# EAGLE design untitled (EAGLE 6.1)
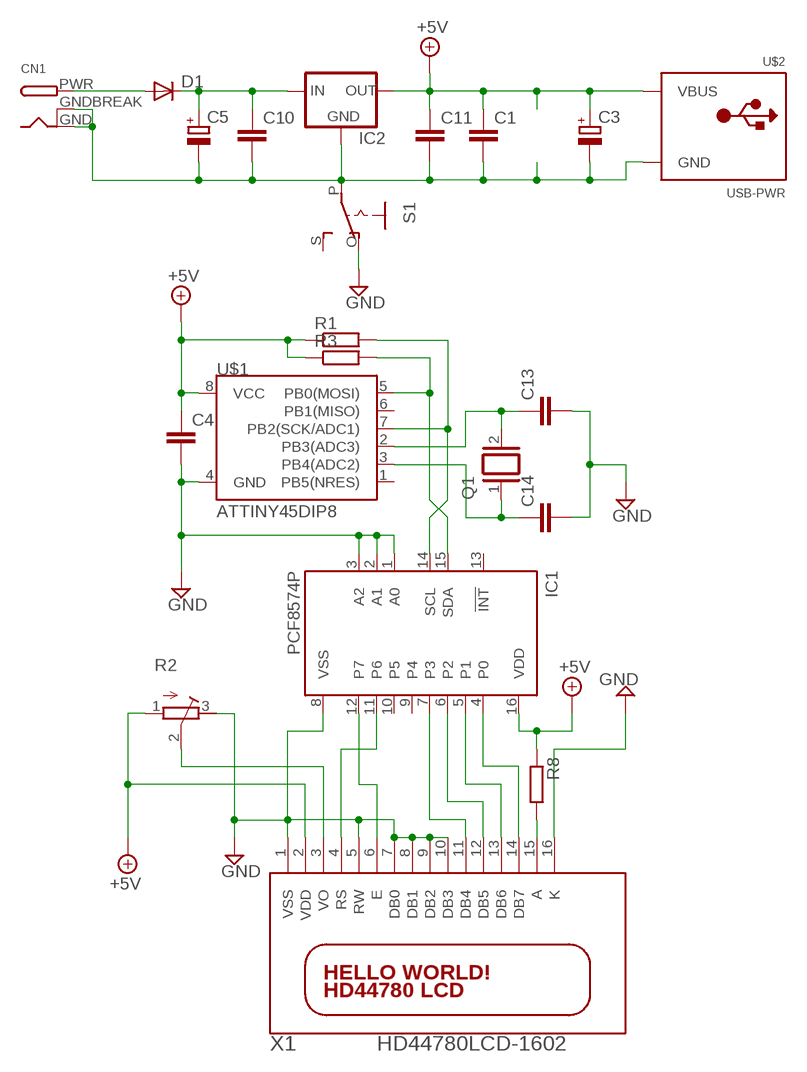
[diagram p0: schematic, sheet 1]

## Parts
C1  C-EU025-025X050  [C025-025X050]
C3  CPOL-EUE2.5-6  [E2,5-6]
C4  C-EU025-025X050  [C025-025X050]
C5  CPOL-EUE2.5-6  [E2,5-6]
C10  C-EU025-025X050  [C025-025X050]
C11  C-EU025-025X050  [C025-025X050]
C13  C-EU025-025X050  [C025-025X050]
C14  C-EU025-025X050  [C025-025X050]
CN1  DCBARRELPTH  [DCJACK_2MM_PTH]
D1  DIODE-D-2.5  [D-2.5]
IC1  PCF8574P  [DIL16]
IC2  V_REG_78XXSIDE  [78XXL]
Q1  XTAL/S  [QS]
R1  R-EU_0207/2V  [0207/2V]
R2  R-TRIMM3339P  [RTRIM3339P]
R3  R-EU_0207/5V  [0207/5V]
R8  R-EU_0207/10  [0207/10]
S1  EG1218S  [EG1218]
U$1  ATTINY45DIP8  [DIP08]
U$2  USB-PWR  [USB-MINIB-THM-MOLEX-PWRONLY]
X1  HD44780LCD-1602  [LCD1602]

## Nets
+5V: C1.1 C3.+ C4.1 C11.1 IC1.16(VDD) IC2.OUT R1.1 R2.1(A) R3.1 R8.1 U$1.8(VCC) U$2.VBUS X1.2(VDD)
GND: C4.2 C13.2 C14.2 IC1.1(A0) IC1.2(A1) IC1.3(A2) IC1.8(VSS) R2.3(E) S1.O U$1.4(GND) X1.1(VSS) X1.5(RW) X1.7(DB0) X1.8(DB1) X1.9(DB2) X1.10(DB3) X1.16(K)
N$1: C5.+ C10.1 D1.C IC2.IN
N$2: IC1.12(P7) X1.6(E)
N$3: IC1.6(P2) X1.12(DB5)
N$4: IC1.7(P3) X1.11(DB4)
N$5: R8.2 X1.15(A)
N$6: IC1.5(P1) X1.13(DB6)
N$7: IC1.4(P0) X1.14(DB7)
N$8: R2.2(S) X1.3(VO)
N$9: C1.2 C3.- C5.- C10.2 C11.2 CN1.GND CN1.GNDBREAK IC2.GND S1.P U$2.GND
N$11: C13.1 Q1.2 U$1.2(PB3(ADC3))
N$12: IC1.11(P6) X1.4(RS)
N$13: C14.1 Q1.1 U$1.3(PB4(ADC2))
N$14: CN1.PWR D1.A
N$16: IC1.15(SDA) R3.2 U$1.5(PB0(MOSI))
N$17: IC1.14(SCL) R1.2 U$1.7(PB2(SCK/ADC1))
Unconnected: IC1.9(P4) IC1.10(P5) IC1.13(!INT) S1.S U$1.1(PB5(NRES)) U$1.6(PB1(MISO))

## Library data of the parts
C1 C4 C10 C11 C13 C14 = rcl:C-EU: CAPACITOR, European symbol
C3 C5 = rcl:CPOL-EU: POLARIZED CAPACITOR, European symbol
CN1 = adafruit:DCBARREL: 2.0mm DC Barrel Jack DCJACK_2MM_PTH - Through Hole Jack (4UConnector: 05537)
D1 = diode:DIODE-: DIODE
IC1 = micro-philips:PCF8574: I2C-Bus Remote 8-bit I/O expander http://www.semiconductors.philips.com/acrobat_download/datasheets/PCF8574_4.pdf; MPN: PCF8574PN; OC_FARNELL: 204020; OC_NEWARK: 11N8515
IC2 = SparkFun:V_REG_78XX: Voltage Regulator Standard 7805 5V regulator. IGO (Input Ground Output). Spark Fun Electronics SKU : COM-00107
Q1 = special:XTAL/S: CRYSTAL
R1 R3 R8 = rcl:R-EU_: RESISTOR, European symbol
R2 = rcl:R-TRIMM: Trimm resistor
S1 = adafruit:EG1218: SLIDING SWITCH 0.1" spacing through hole, vertical SPDT slide switch http://www.ladyada.net/library/pcb/eaglelibrary.html
U$1 = SparkFun:ATTINY45: Atmel ATTiny45
U$2 = adafruit:USB-PWR
X1 = adafruit:HD44780LCD: HD44780 LCD Standard character type LCDs, available in sizes from 8x1 to 40x4!

## Board
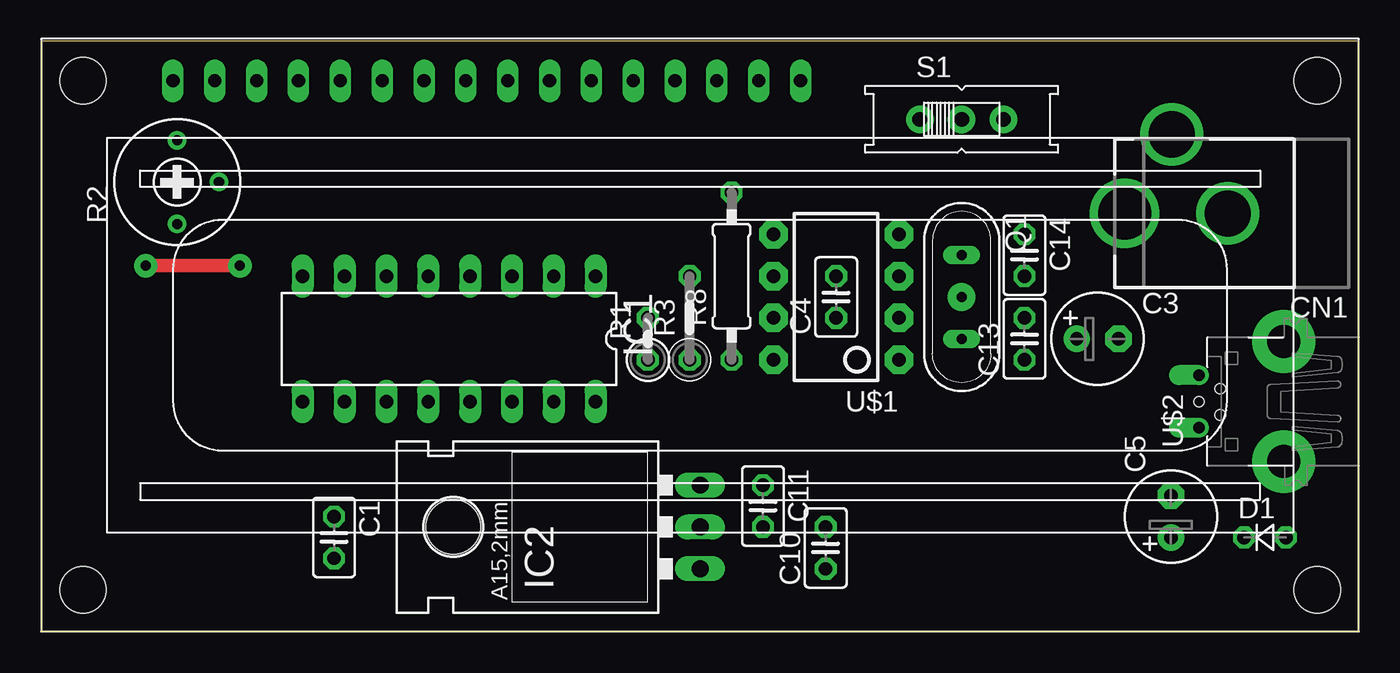
[diagram p1: board, top side]
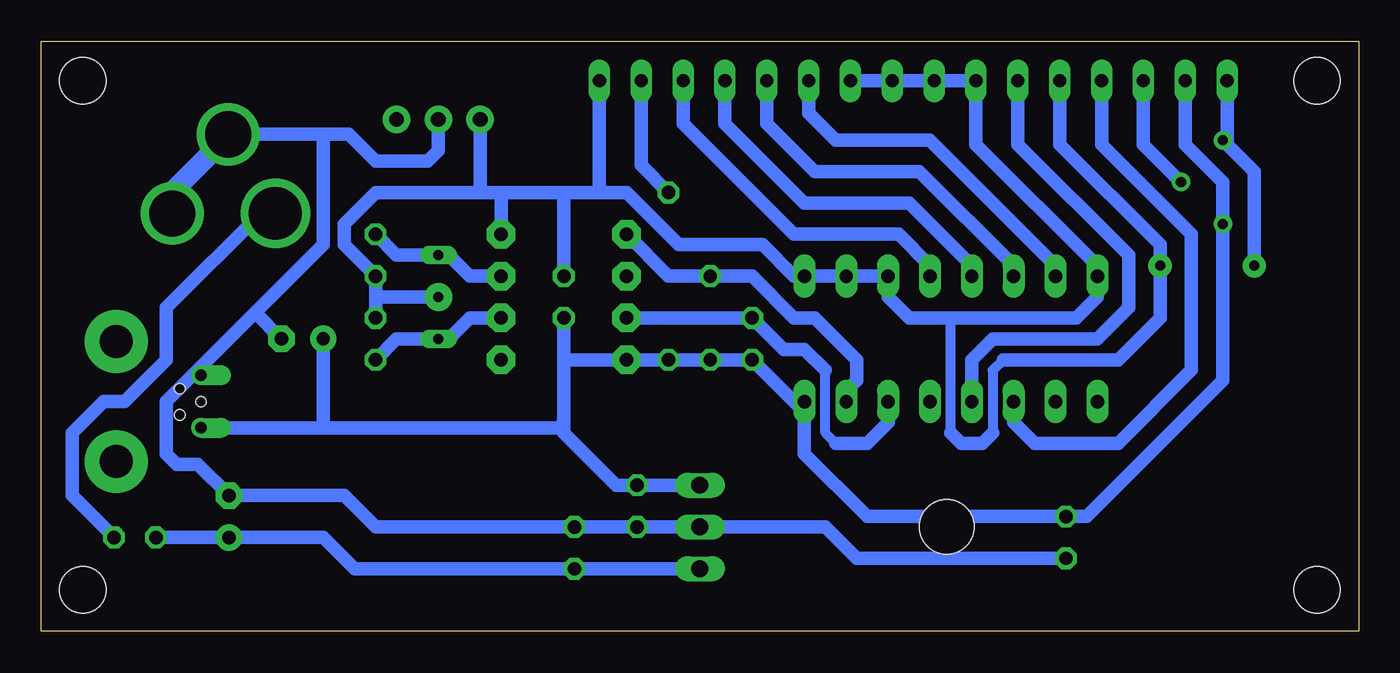
[diagram p2: board, bottom side, seen from below]

Size 79.99 x 35.87 mm. Coordinates in mm from the lower left corner, seen from the top.
Outline: 0,0 79.99,0 79.99,35.87 0,35.87 0,0
Copper layers (1*16): Top 0.035mm / dielectric 1.5mm / Bottom 0.035mm
Design rules: minimum track width 10mil, minimum drill 24mil, track to track 8mil, track to pad 8mil, pad to pad 8mil, via to via 8mil, smd to smd 8mil, copper to edge 40mil, drill to drill 8mil, minimum pad ring 10mil, minimum via ring 8mil, stop-mask expansion 4mil, vias tented up to drill 0mil, thermal gap 10mil

### Footprints (pad centres in the part's own frame; a part is rotated, then mirrored left to right if it is on the bottom)
C025-025X050 = drill 0.813 octagon: 1 -1.27,0; 2 1.27,0
E2,5-6 = drill 0.813 pad 1.6: + -1.27,0 | drill 0.813 pad 1.6 octagon: - 1.27,0
DCJACK_2MM_PTH = drill 2.8: GND 0,7.35; GNDBREAK 4.8,10.75 | drill 3.2: PWR 0,13.6
D-2.5 = drill 0.813 octagon: A 1.27,0; C -1.27,0
DIL16 = drill 0.813 long: 1 -8.89,-3.81; 2 -6.35,-3.81; 3 -3.81,-3.81; 4 -1.27,-3.81; 5 1.27,-3.81; 6 3.81,-3.81; 7 6.35,-3.81; 8 8.89,-3.81; 9 8.89,3.81; 10 6.35,3.81; 11 3.81,3.81; 12 1.27,3.81; 13 -1.27,3.81; 14 -3.81,3.81; 15 -6.35,3.81; 16 -8.89,3.81
78XXL = drill 1.016 long: GND 0,-3.81; IN -2.54,-3.81; OUT 2.54,-3.81 | hole 3.302: 0,11.176
QS = drill 0.61 long: 1 -2.54,0; 2 2.54,0
0207/2V = drill 0.813 octagon: 1 -1.27,0; 2 1.27,0
RTRIM3339P = drill 0.61: 1 -2.54,0; 2 0,-2.54; 3 2.54,0
0207/5V = drill 0.813 octagon: 1 -2.54,0; 2 2.54,0
0207/10 = drill 0.813 octagon: 1 -5.08,0; 2 5.08,0
EG1218 = drill 0.9 pad 1.676: O -2.54,0; P 0,0; S 2.54,0
DIP08 = drill 0.813 pad 1.727 octagon: 1 -3.81,-3.81; 2 -1.27,-3.81; 3 1.27,-3.81; 4 3.81,-3.81; 5 3.81,3.81; 6 1.27,3.81; 7 -1.27,3.81; 8 -3.81,3.81
USB-MINIB-THM-MOLEX-PWRONLY = drill 0.7 offset: GND 1.6,4.64; VBUS -1.6,4.64 | drill 2 pad 3.81: GND1 -3.65,-0.51; GND4 3.65,-0.51 | hole 0.6: 0,4.648; 0.787,3.353; -0.813,3.353
LCD1602 = drill 0.8 long: 1 8,33.46; 2 10.54,33.46; 3 13.08,33.46; 4 15.62,33.46; 5 18.16,33.46; 6 20.7,33.46; 7 23.24,33.46; 8 25.78,33.46; 9 28.32,33.46; 10 30.86,33.46; 11 33.4,33.46; 12 35.94,33.46; 13 38.48,33.46; 14 41.02,33.46; 15 43.56,33.46; 16 46.1,33.46 | hole 2.8: 2.54,2.54; 2.54,33.46; 77.46,33.46; 77.46,2.54

### Placement (x,y rotation side)
C1  17.78,5.71 270 top
C3  64.14,17.78 0 top
C4  48.26,20.32 90 top
C5  68.58,6.99 90 top
C10  47.62,5.08 90 top
C11  43.81,7.62 270 top
C13  59.69,17.78 90 top
C14  59.69,22.86 270 top
CN1  79.38,25.4 90 top
D1  74.3,5.71 0 top
IC1  24.77,17.78 180 top
IC2  36.2,6.35 90 top
Q1  55.88,20.32 270 top
R1  36.83,17.78 90 top
R2  8.26,27.3 90 top
R3  39.37,19.05 90 top
R8  41.91,21.59 90 top
S1  55.88,31.11 0 top
U$1  48.26,20.32 90 top
U$2  74.93,13.97 90 top
X1  0,0 0 top

### Tracks (layer width: path | path; a pad name or v marks a point on that pad's centre or on a via)
+5V
  Bottom 0.813: C4.1 48.26,16.51 | 48.26,16.51 U$1.8 R8.1 R3.1 R1.1 33.66,13.34 | 33.66,13.34 33.66,10.79 29.84,6.99 C1.1 16.51,6.99 8.26,15.24 R2.1 8.26,27.3 10.54,29.59 X1.2 | U$2.VBUS 62.87,12.37 | 62.87,12.37 48.56,12.37 48.56,12.39 48.26,12.7 | IC2.OUT C11.1 45.09,8.89 48.26,12.06 48.26,12.7 | 48.26,16.51 48.26,12.7 | C3.+ 62.87,12.37 | 33.66,13.34 IC1.16
GND  (via drill 0.6 pad 1.42, 0.6 pad 1.68)
  Top 0.813: v6.35,22.23 v12.06,22.23
  Bottom 0.61: 21.59,16.51 22.23,15.88 22.23,12.06 | 24.77,12.06 24.77,19.05
  Bottom 0.813: 59.69,20.32 C13.2 C14.2 | 59.69,20.32 C14.2 | v55.88,20.32 59.69,20.32 | X1.10 X1.9 X1.8 X1.7 23.24,29.59 15.88,22.23 IC1.8 15.88,20.32 17.14,19.05 24.77,19.05 27.3,19.05 28.57,20.32 IC1.3 IC1.2 IC1.1 34.29,21.59 36.2,23.5 41.27,23.5 44.45,26.67 46.1,26.67 | 48.26,26.67 46.1,26.67 | X1.16 46.1,26.67 | C4.2 48.26,26.67 | 48.26,26.67 52.07,26.67 | U$1.4 52.07,26.67 | 53.34,26.67 S1.O | 52.07,26.67 53.34,26.67 | C14.2 61.59,23.5 61.59,24.77 59.69,26.67 53.34,26.67 | 21.59,16.51 14.61,16.51 12.06,19.05 v12.06,22.23 12.06,23.5 18.16,29.59 X1.5 | 22.23,12.06 22.86,11.43 24.13,11.43 24.77,12.06 | X1.1 8,29.84 | 8,29.84 8,29.59 6.35,27.94 v6.35,22.23 | R2.3 8,29.84
N$1
  Bottom 0.813: D1.C C5.+ 62.87,5.71 60.96,3.81 C10.1 IC2.IN
N$2
  Bottom 0.813: X1.6 20.7,29.59 13.97,22.86 13.97,19.68 15.88,17.78 22.23,17.78 23.5,16.51 IC1.12
N$3
  Bottom 0.813: IC1.6 20.95,22.23 26.67,27.94 33.02,27.94 35.94,30.86 X1.12
N$4
  Bottom 0.813: IC1.7 18.41,22.23 26.04,29.84 31.75,29.84 33.4,31.5 X1.11
N$5
  Bottom 0.813: X1.15 43.56,28.32 R8.2
N$6
  Bottom 0.813: IC1.5 23.5,22.23 27.3,26.04 33.66,26.04 38.48,30.86 X1.13
N$7
  Bottom 0.813: IC1.4 26.04,22.23 27.94,24.13 34.29,24.13 41.02,30.86 X1.14
N$8
  Bottom 0.813: X1.3 13.08,29.59 R2.2
N$9
  Bottom 0.813: 71.75,27.3 68.86,30.2 CN1.GNDBREAK 62.87,30.2 | 70.48,15.88 72.39,13.97 72.39,10.79 71.75,10.16 70.48,10.16 C5.- 61.59,8.26 59.69,6.35 C10.2 C11.2 IC2.GND 32.38,6.35 30.48,4.45 C1.2 | U$2.GND 70.29,15.68 70.48,15.88 | S1.P 55.88,29.21 56.52,28.57 59.69,28.57 61.31,30.2 62.87,30.2 | CN1.GND 72.03,27.04 71.75,27.3 | 71.75,27.3 71.12,27.3 68.58,29.84 | 70.48,15.88 66.99,19.37 | 66.99,19.37 62.87,23.5 62.87,30.2 | C3.- 66.99,19.37
N$11
  Bottom 0.813: U$1.2 53.98,19.05 55.24,17.78 Q1.2 58.42,17.78 C13.1
N$12
  Bottom 0.813: X1.4 15.62,29.59 10.16,24.13 10.16,15.88 14.61,11.43 19.68,11.43 20.95,12.7 IC1.11
N$13
  Bottom 0.813: U$1.3 53.98,21.59 55.24,22.86 Q1.1 58.42,22.86 C14.1
N$14
  Bottom 0.813: CN1.PWR 66.67,25.4 72.39,19.68 72.39,16.51 74.93,13.97 76.2,13.97 78.11,12.06 78.11,8.26 D1.A
N$16
  Bottom 0.813: U$1.5 41.91,21.59 R3.2 36.83,21.59 34.29,19.05 33.02,19.05 30.48,16.51 30.48,15.24 31.11,14.61 IC1.15
N$17
  Bottom 0.61: 32.38,15.88 32.38,12.06 31.75,11.43
  Bottom 0.813: IC1.14 28.57,12.7 29.84,11.43 31.75,11.43 | U$1.7 R1.2 34.92,17.14 33.66,17.14 32.38,15.88